# Altium schematic sheet AudioAmplifierBasic.SchDoc
size A4; SheetNumber: 1; SheetTotal: 5
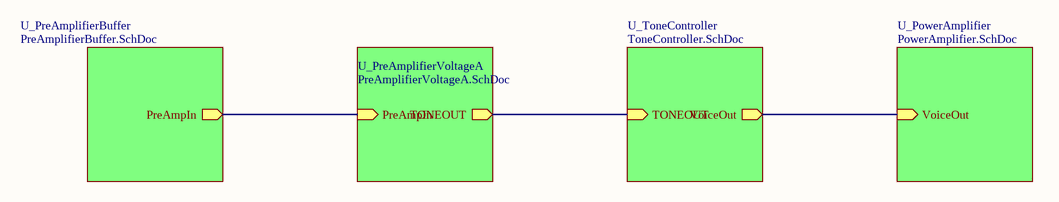
[diagram p0: AudioAmplifierBasic.SchDoc]

## Sub-sheets
U_PowerAmplifier = PowerAmplifier.SchDoc: VoiceOut (in)
U_PreAmplifierBuffer = PreAmplifierBuffer.SchDoc: PreAmpIn (out)
U_PreAmplifierVoltageA = PreAmplifierVoltageA.SchDoc: PreAmpIn (in), TONEOUT (out)
U_ToneController = ToneController.SchDoc: TONEOUT (in), VoiceOut (out)

## Nets
(unnamed): sheet U_PreAmplifierBuffer/PreAmpIn, sheet U_PreAmplifierVoltageA/PreAmpIn
(unnamed): sheet U_PreAmplifierVoltageA/TONEOUT, sheet U_ToneController/TONEOUT
(unnamed): sheet U_ToneController/VoiceOut, sheet U_PowerAmplifier/VoiceOut